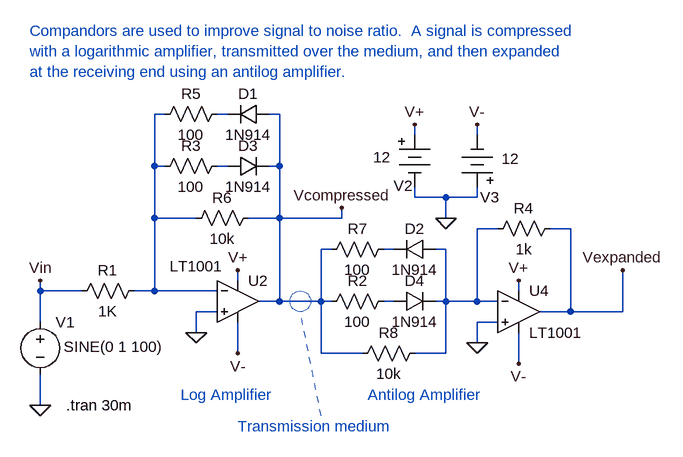
[diagram p0: schematic Compandor.asc]
Compandor.asc, the LTspice schematic file:
Version 4
SHEET 1 5945676 13421556
WIRE 1040 -272 1024 -272
WIRE 1136 -272 1120 -272
WIRE 1216 -272 1200 -272
WIRE 1424 -240 1424 -256
WIRE 1520 -240 1520 -256
WIRE 1024 -192 1024 -272
WIRE 1040 -192 1024 -192
WIRE 1136 -192 1120 -192
WIRE 1216 -192 1216 -272
WIRE 1216 -192 1200 -192
WIRE 1424 -144 1424 -160
WIRE 1472 -144 1424 -144
WIRE 1520 -144 1520 -160
WIRE 1520 -144 1472 -144
WIRE 1024 -112 1024 -192
WIRE 1088 -112 1024 -112
WIRE 1216 -112 1216 -192
WIRE 1216 -112 1168 -112
WIRE 1312 -112 1312 -128
WIRE 1312 -112 1216 -112
WIRE 1472 -112 1472 -144
WIRE 1552 -96 1520 -96
WIRE 1664 -96 1632 -96
WIRE 1296 -64 1280 -64
WIRE 1392 -64 1376 -64
WIRE 1472 -64 1456 -64
WIRE 1152 -16 1152 -32
WIRE 848 0 848 -16
WIRE 912 0 848 0
WIRE 1024 0 1024 -112
WIRE 1024 0 992 0
WIRE 1120 0 1024 0
WIRE 1584 0 1584 -16
WIRE 1216 16 1216 -112
WIRE 1216 16 1184 16
WIRE 1280 16 1280 -64
WIRE 1280 16 1216 16
WIRE 1296 16 1280 16
WIRE 1392 16 1376 16
WIRE 1472 16 1472 -64
WIRE 1472 16 1456 16
WIRE 1520 16 1520 -96
WIRE 1520 16 1472 16
WIRE 1552 16 1520 16
WIRE 1120 32 1088 32
WIRE 1664 32 1664 -96
WIRE 1664 32 1616 32
WIRE 1744 32 1744 -32
WIRE 1744 32 1664 32
WIRE 848 48 848 0
WIRE 1552 48 1520 48
WIRE 1088 64 1088 32
WIRE 1520 80 1520 48
WIRE 1152 96 1152 48
WIRE 1280 96 1280 16
WIRE 1344 96 1280 96
WIRE 1472 96 1472 16
WIRE 1472 96 1424 96
WIRE 1584 112 1584 64
WIRE 848 176 848 128
FLAG 848 176 0
FLAG 1472 -112 0
FLAG 1424 -256 V+
FLAG 1520 -256 V-
FLAG 1152 -32 V+
FLAG 1584 -16 V+
FLAG 1152 96 V-
FLAG 1584 112 V-
FLAG 1088 64 0
FLAG 1520 80 0
FLAG 848 -16 Vin
FLAG 1312 -128 Vcompressed
FLAG 1744 -32 Vexpanded
SYMBOL RES 1008 -16 R90
WINDOW 0 0 56 VBottom 0
WINDOW 3 32 56 VTop 0
SYMATTR InstName R1
SYMATTR Value 1K
SYMBOL diode 1200 -288 R90
WINDOW 0 0 32 VBottom 0
WINDOW 3 32 32 VTop 0
SYMATTR InstName D1
SYMATTR Value 1N914
SYMBOL res 1648 -112 R90
WINDOW 0 0 56 VBottom 0
WINDOW 3 32 56 VTop 0
SYMATTR InstName R4
SYMATTR Value 1k
SYMBOL voltage 848 32 R0
WINDOW 123 0 0 Left 0
WINDOW 39 0 0 Left 0
WINDOW 3 36 54 Left 0
SYMATTR InstName V1
SYMATTR Value SINE(0 1 100)
SYMBOL Opamps\\LT1001 1152 -48 R0
WINDOW 3 -105 10 Left 0
SYMATTR InstName U2
SYMBOL Opamps\\LT1001 1584 -32 R0
SYMATTR InstName U4
SYMBOL Misc\\battery 1424 -256 R0
WINDOW 0 -32 94 Left 0
WINDOW 3 -64 50 Left 0
WINDOW 123 0 0 Left 0
WINDOW 39 0 0 Left 0
SYMATTR InstName V2
SYMATTR Value 12
SYMBOL Misc\\battery 1520 -144 R180
WINDOW 0 -34 0 Left 0
WINDOW 3 -65 59 Left 0
WINDOW 123 0 0 Left 0
WINDOW 39 0 0 Left 0
SYMATTR InstName V3
SYMATTR Value 12
SYMBOL diode 1136 -176 R270
WINDOW 0 32 32 VTop 0
WINDOW 3 0 32 VBottom 0
SYMATTR InstName D3
SYMATTR Value 1N914
SYMBOL res 1136 -208 R90
WINDOW 0 0 56 VBottom 0
WINDOW 3 32 56 VTop 0
SYMATTR InstName R3
SYMATTR Value 100
SYMBOL res 1136 -288 R90
WINDOW 0 0 56 VBottom 0
WINDOW 3 32 56 VTop 0
SYMATTR InstName R5
SYMATTR Value 100
SYMBOL res 1184 -128 R90
WINDOW 0 0 56 VBottom 0
WINDOW 3 32 56 VTop 0
SYMATTR InstName R6
SYMATTR Value 10k
SYMBOL diode 1456 -80 R90
WINDOW 0 0 32 VBottom 0
WINDOW 3 32 32 VTop 0
SYMATTR InstName D2
SYMATTR Value 1N914
SYMBOL diode 1392 32 R270
WINDOW 0 32 32 VTop 0
WINDOW 3 0 32 VBottom 0
SYMATTR InstName D4
SYMATTR Value 1N914
SYMBOL res 1392 0 R90
WINDOW 0 0 56 VBottom 0
WINDOW 3 32 56 VTop 0
SYMATTR InstName R2
SYMATTR Value 100
SYMBOL res 1392 -80 R90
WINDOW 0 0 56 VBottom 0
WINDOW 3 32 56 VTop 0
SYMATTR InstName R7
SYMATTR Value 100
SYMBOL res 1440 80 R90
WINDOW 0 0 56 VBottom 0
WINDOW 3 32 56 VTop 0
SYMATTR InstName R8
SYMATTR Value 10k
TEXT 888 176 Left 0 !.tran 30m
TEXT 1064 160 Left 0 ;Log Amplifier
TEXT 1352 160 Left 0 ;Antilog Amplifier
TEXT 832 -400 Left 0 ;Compandors are used to improve signal to noise ratio.  A signal is compressed\nwith a logarithmic amplifier, transmitted over the medium, and then expanded\nat the receiving end using an antilog amplifier.
TEXT 1152 208 Left 0 ;Transmission medium
LINE Normal 1280 192 1248 32 2
LINE Normal 1280 192 1280 192
LINE Normal 1280 192 1280 192
LINE Normal 1280 192 1280 192
CIRCLE Normal 1264 32 1232 0 2

The netlist it stands for:
* Compandor.asc
R1 N001 Vin 1K
D1 Vcompressed N002 1N914
R4 Vexpanded N004 1k
V1 Vin 0 SINE(0 1 100)
XU2 0 N001 V+ V- Vcompressed LT1001  ; pins In+ In- V+ V- OUT
XU4 0 N004 V+ V- Vexpanded LT1001  ; pins In+ In- V+ V- OUT
V2 V+ 0 12
V3 0 V- 12
D3 N003 Vcompressed 1N914
R3 N003 N001 100
R5 N002 N001 100
R6 Vcompressed N001 10k
D2 N004 N005 1N914
D4 N006 N004 1N914
R2 N006 Vcompressed 100
R7 N005 Vcompressed 100
R8 N004 Vcompressed 10k
.model D D
.lib standard.dio
.tran 30m
* Log Amplifier
* Antilog Amplifier
* Compandors are used to improve signal to noise ratio.  A signal is compressed
* with a logarithmic amplifier, transmitted over the medium, and then expanded
* at the receiving end using an antilog amplifier.
* Transmission medium
.lib LTC.lib
.backanno
.end